# Altium project CME-M5_DevBrd.PrjPcb
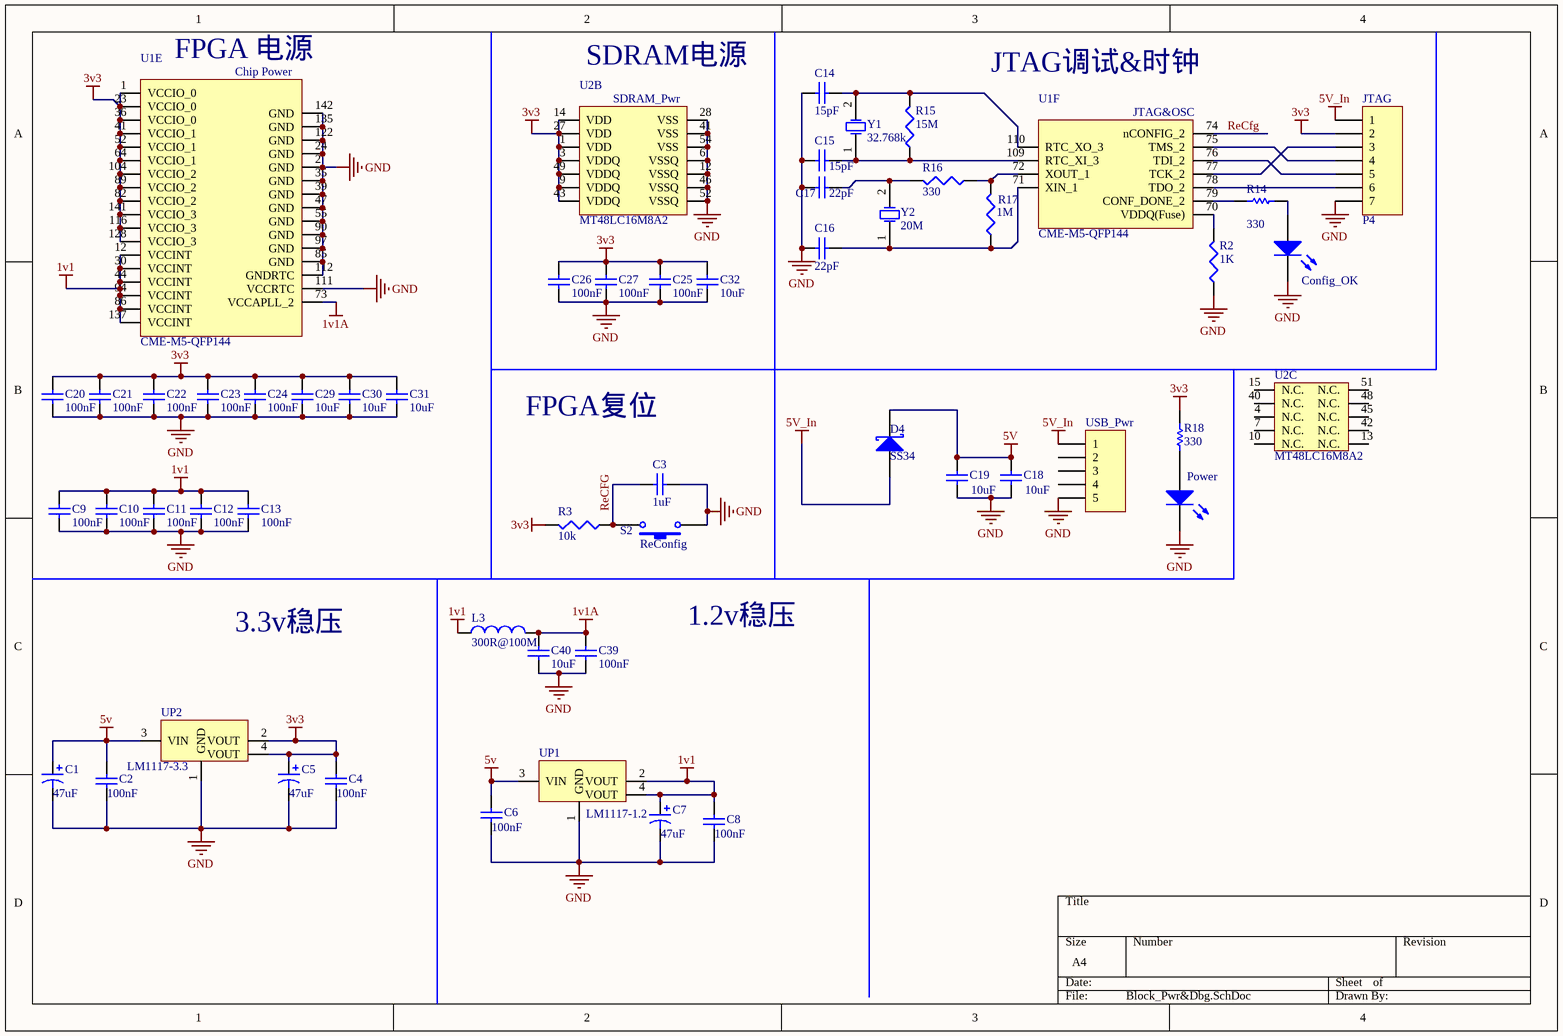
[diagram p0: Block_Pwr&Dbg.SchDoc]
2 sheets, 58 parts. Net scope: global (net labels, ports and power ports of the same name join across sheets).
Board file: CME-M5_DevBrd.PcbDoc
Sheets:
  Block_Pwr&Dbg.SchDoc
  CME-M5_DevBrd.SchDoc

## Sheet Block_Pwr&Dbg.SchDoc
size A4

### Parts
(Parts that share a designator on the sheet are numbered #1, #2 ... from top to bottom, then left to right.)
C1  value 47uF  [TanCap-1210]  (hidden comment: Cap Pol3)
C2  value 100nF  [6-0805_M]  (hidden comment: Cap)
C3  value 1uF  [6-0805_M]  (hidden comment: Cap)
C4  value 100nF  [6-0805_M]  (hidden comment: Cap)
C5  value 47uF  [TanCap-1210]  (hidden comment: Cap Pol3)
C6  value 100nF  [6-0805_M]  (hidden comment: Cap)
C7  value 47uF  [TanCap-1210]  (hidden comment: Cap Pol3)
C8  value 100nF  [6-0805_M]  (hidden comment: Cap)
C9  value 100nF  [6-0805_M]  (hidden comment: Cap)
C10  value 100nF  [6-0805_M]  (hidden comment: Cap)
C11  value 100nF  [6-0805_M]  (hidden comment: Cap)
C12  value 100nF  [6-0805_M]  (hidden comment: Cap)
C13  value 100nF  [6-0805_M]  (hidden comment: Cap)
C14  value 15pF  [6-0805_M]  (hidden comment: Cap)
C15  value 15pF  [6-0805_M]  (hidden comment: Cap)
C16  value 22pF  [6-0805_M]  (hidden comment: Cap)
C17  value 22pF  [6-0805_M]  (hidden comment: Cap)
C18  value 10uF  [6-0805_M]  (hidden comment: Cap)
C19  value 10uF  [6-0805_M]  (hidden comment: Cap)
C20  value 100nF  [6-0805_M]  (hidden comment: Cap)
C21  value 100nF  [6-0805_M]  (hidden comment: Cap)
C22  value 100nF  [6-0805_M]  (hidden comment: Cap)
C23  value 100nF  [6-0805_M]  (hidden comment: Cap)
C24  value 100nF  [6-0805_M]  (hidden comment: Cap)
C25  value 100nF  [6-0805_M]  (hidden comment: Cap)
C26  value 100nF  [6-0805_M]  (hidden comment: Cap)
C27  value 100nF  [6-0805_M]  (hidden comment: Cap)
C29  value 10uF  [6-0805_M]  (hidden comment: Cap)
C30  value 10uF  [6-0805_M]  (hidden comment: Cap)
C31  value 10uF  [6-0805_M]  (hidden comment: Cap)
C32  value 10uF  [6-0805_M]  (hidden comment: Cap)
C39#1  value 100nF  [6-0805_M]  (hidden comment: Cap)
C40  value 10uF  [6-0805_M]  (hidden comment: Cap)
Config_OK  LED2  [6-0805_Diode]  (value not drawn)
D4  SS34  [SMB]
JTAG  P4  [HDR1X7]
L3  value 300R@100M  [6-0805_M]  (hidden comment: Inductor)
Power  LED2  [6-0805_Diode]  (value not drawn)
R2  value 1K  [6-0805_M]  (hidden comment: Res3)
R3  value 10k  [6-0805_M]  (hidden comment: Res3)
R14  value 330  [6-0805_M]  (hidden comment: Res1)
R15  value 15M  [6-0805_M]  (hidden comment: Res3)
R16  value 330  [6-0805_M]  (hidden comment: Res3)
R17  value 1M  [6-0805_M]  (hidden comment: Res3)
R18  value 330  [6-0805_M]  (hidden comment: Res1)
ReConfig  S2  [Switch_SMT-022S-H2.5]
U1  CME-M5-QFP144  [QFP144N-50P2200X2200X160]  (parts E,F of 6)
U2  MT48LC16M8A2  [TSOP54-80P1180X100-]  (parts B,C of 3)
UP1  LM1117-1.2  [SOT223_M]
UP2  LM1117-3.3  [SOT223_M]
USB_Pwr  Header 5  [MicroUSB]  (value not drawn)
Y1  32.768k  [XTAL-3215]
Y2  20M  [XTAL-5032]

### Nets
1v1: C7.1 C8.2 C9.2 C10.2 C11.2 C12.2 C13.2 L3.1 U1.12(VCCINT) U1.30(VCCINT) U1.44(VCCINT) U1.86(VCCINT) U1.94(VCCINT) U1.137(VCCINT) UP1.2(VOUT) UP1.4(VOUT)
1v1A: C39#1.2 C40.2 L3.2 U1.73(VCCAPLL_2)
3v3: C4.2 C5.1 C20.2 C21.2 C22.2 C23.2 C24.2 C25.2 C26.2 C27.2 C29.2 C30.2 C31.2 C32.2 JTAG.2 R3.2 R18.1 U1.1(VCCIO_0) U1.23(VCCIO_0) U1.36(VCCIO_0) U1.41(VCCIO_1) U1.52(VCCIO_1) U1.64(VCCIO_1) U1.82(VCCIO_2) U1.89(VCCIO_2) U1.104(VCCIO_2) U1.116(VCCIO_3) U1.128(VCCIO_3) U1.141(VCCIO_3) U2.1(VDD) U2.3(VDDQ) U2.9(VDDQ) U2.14(VDD) U2.27(VDD) U2.43(VDDQ) U2.49(VDDQ) UP2.2(VOUT) UP2.4(VOUT)
5V: C1.1 C2.2 C6.2 C18.2 C19.2 D4.2(K) UP1.3(VIN) UP2.3(VIN)
5V_In: D4.1(A) JTAG.1 USB_Pwr.1
GND: C1.2 C2.1 C3.1 C4.1 C5.2 C6.1 C7.2 C8.1 C9.1 C10.1 C11.1 C12.1 C13.1 C14.1 C15.1 C16.1 C17.1 C18.1 C19.1 C20.1 C21.1 C22.1 C23.1 C24.1 C25.1 C26.1 C27.1 C29.1 C30.1 C31.1 C32.1 C39#1.1 C40.1 Config_OK.2(K) JTAG.7 Power.2(K) R2.1 ReConfig.1 U1.2(GND) U1.24(GND) U1.35(GND) U1.39(GND) U1.47(GND) U1.55(GND) U1.85(GND) U1.90(GND) U1.97(GND) U1.111(VCCRTC) U1.112(GNDRTC) U1.122(GND) U1.135(GND) U1.142(GND) U2.6(VSSQ) U2.12(VSSQ) U2.28(VSS) U2.41(VSS) U2.46(VSSQ) U2.52(VSSQ) U2.54(VSS) UP1.1(GND) UP2.1(GND) USB_Pwr.5
ReCfg: C3.2 R3.1 ReConfig.2 U1.74(nCONFIG_2)
NetC14_2: C14.2 R15.2 U1.110(RTC_XO_3) Y1.2(OSC2)
NetC15_2: C15.2 R15.1 U1.109(RTC_XI_3) Y1.1(OSC1)
NetC16_2: C16.2 R17.1 U1.71(XIN_1) Y2.1(OSC1)
NetC17_2: C17.2 R16.2 Y2.2(OSC2)
NetConfig_OK_1: Config_OK.1(A) R14.2
NetJTAG_3: JTAG.3 U1.77(TCK_2)
NetJTAG_4: JTAG.4 U1.75(TMS_2)
NetJTAG_5: JTAG.5 U1.76(TDI_2)
NetJTAG_6: JTAG.6 U1.78(TDO_2)
NetPower_1: Power.1(A) R18.2
NetR2_2: R2.2 U1.70(VDDQ(Fuse))
NetR14_1: R14.1 U1.79(CONF_DONE_2)
NetR16_1: R16.1 R17.2 U1.72(XOUT_1)

Not connected (* = marked no-connect by the designer): U2 4(N.C.) 7(N.C.) 10(N.C.) 13(N.C.) 15(N.C.) 40(N.C.) 42(N.C.) 45(N.C.) 48(N.C.) 51(N.C.); USB_Pwr 2 3 4

### Notes on the sheet
- (near U1) FPGA 电源
- (near U2) SDRAM电源
- JTAG调试&时钟
- FPGA复位
- 3.3v稳压
- 1.2v稳压
- (in symbol CME-M5-QFP144, part E) Chip Power
- (in symbol CME-M5-QFP144, part F) JTAG&OSC
- (in symbol SDRAM-8, part B) SDRAM_Pwr

### Library data of the parts
C1 C5 C7 = Cap Pol3: Polarized Capacitor (Surface Mount); Published: 8-Jun-2000; LatestRevisionDate: 29-May-2009; LatestRevisionNote: IPC-7351 Footprint Added.; PackageReference: C0805; Publisher: Altium Limited; PackageDescription: Chip Capacitor
C2-C4 C6 C8-C27 C29-C32 C39#1 C40 = Cap: Capacitor; Published: 8-Jun-2000; LatestRevisionDate: 17-Jul-2002; LatestRevisionNote: Re-released for DXP Platform.; PackageReference: RAD-0.3; Publisher: Altium Limited; PackageDescription: Radial Cap, Thru-Hole; 2 Leads; 0.3 in Pin Spacing
Config_OK Power = LED2: Typical RED, GREEN, YELLOW, AMBER GaAs LED; Published: 8-Jun-2000; LatestRevisionDate: 17-Jul-2002; LatestRevisionNote: Re-released for DXP Platform.; PackageVersion: Feb-2002; PackageReference: 3.2X1.6X1.1; Publisher: Altium Limited; PackageDescription: SM LED; 2 Flat Leads
D4 = D Schottky: Schottky Diode; Published: 8-Jun-2000; LatestRevisionDate: 17-Jul-2002; LatestRevisionNote: Re-released for DXP Platform.; PackageReference: SMB; Publisher: Altium Limited; PackageDescription: DO-214-AA/SMB; 2 C-Bend Leads; Body 5.3 x 3.6 mm, inc. leads (LxW); Code_JEDEC: DO-214-AA
JTAG = Header 7: Header, 7-Pin; LatestRevisionDate: 17-Jul-2002; LatestRevisionNote: Re-released for DXP Platform.; Publisher: Altium Limited
L3 = Inductor: Code_IEC: 1005; Published: 8-Jun-2000; LatestRevisionDate: 29-May-2009; LatestRevisionNote: IPC-7351 Footprint Added.; PackageReference: 0402-A; Publisher: Altium Limited; PackageDescription: Chip Inductor; Code_JEITA: 0402
R2 R3 R15-R17 = Res3: Resistor; Published: 8-Jun-2000; LatestRevisionDate: 29-May-2009; LatestRevisionNote: IPC-7351 Footprint Added.; PackageReference: J1-0603; Publisher: Altium Limited; PackageDescription: Chip Resistor
R14 R18 = Res1: Resistor; Published: 8-Jun-2000; LatestRevisionDate: 17-Jul-2002; LatestRevisionNote: Re-released for DXP Platform.; PackageReference: AXIAL-0.3; Publisher: Altium Limited; PackageDescription: Axial Device, Thru-Hole; 2 Leads; 0.3 in Pin Spacing
ReConfig = SW-PB: Switch; Published: 24-Mar-1999; LatestRevisionDate: 17-Jul-2002; LatestRevisionNote: Re-released for DXP Platform.; PackageReference: SPST-2; Publisher: Altium Limited; PackageDescription: Switch; 2 Leads
U2 = SDRAM-8
UP1 UP2 = LM1117
USB_Pwr = Header 5: Header, 5-Pin; LatestRevisionDate: 17-Jul-2002; LatestRevisionNote: Re-released for DXP Platform.; Publisher: Altium Limited
Y1 Y2 = XTAL: Crystal Oscillator; Published: 8-Jun-2000; LatestRevisionDate: 17-Jul-2002; LatestRevisionNote: Re-released for DXP Platform.; PackageReference: R38; Publisher: Altium Limited; PackageDescription: Crystal, Thru-Hole; 2 Leads; Body 3.1 x 8.2 mm (Dia.xH)

## Sheet CME-M5_DevBrd.SchDoc
size A4
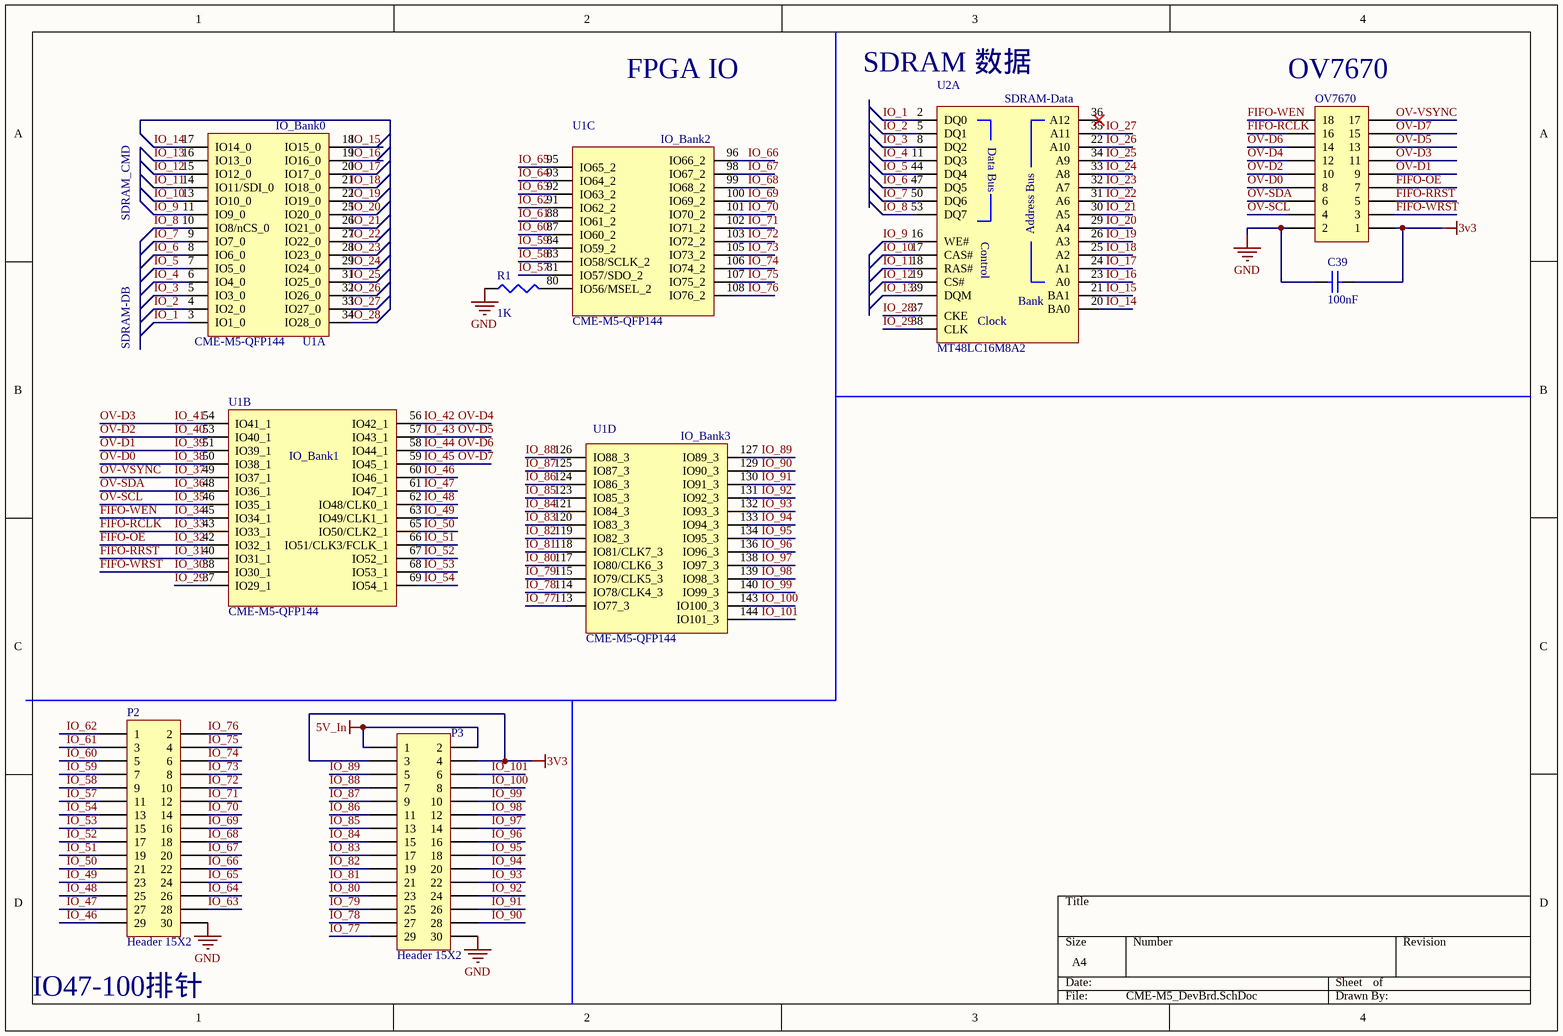
[diagram p1: CME-M5_DevBrd.SchDoc]

### Parts
(Parts that share a designator on the sheet are numbered #1, #2 ... from top to bottom, then left to right.)
C39#2  value 100nF  [6-0805_M]  (hidden comment: Cap)
OV7670  OV7670  [HDR2X9]  (value not drawn)
P2  Header 15X2  [HDR2X15]
P3  Header 15X2  [HDR2X15]
R1  value 1K  [6-0805_M]  (hidden comment: Res3)
U1  CME-M5-QFP144  [QFP144N-50P2200X2200X160]  (parts A,B,C,D of 6)
U2  MT48LC16M8A2  [TSOP54-80P1180X100-]  (part A of 3)

### Nets
3v3: C39#2.2 OV7670.1 P3.3 P3.4
5V_In: P3.1 P3.2
GND: C39#2.1 OV7670.2 P2.30 P3.30 R1.1
FIFO-OE: OV7670.7 U1.42(IO32_1)  [also labelled IO_32]
FIFO-RCLK: OV7670.16 U1.43(IO33_1)  [also labelled IO_33]
FIFO-RRST: OV7670.5 U1.40(IO31_1)  [also labelled IO_31]
FIFO-WEN: OV7670.18 U1.45(IO34_1)  [also labelled IO_34]
FIFO-WRST: OV7670.3 U1.38(IO30_1)  [also labelled IO_30]
IO_1: U1.3(IO1_0) U2.2(DQ0)
IO_2: U1.4(IO2_0) U2.5(DQ1)
IO_3: U1.5(IO3_0) U2.8(DQ2)
IO_4: U1.6(IO4_0) U2.11(DQ3)
IO_5: U1.7(IO5_0) U2.44(DQ4)
IO_6: U1.8(IO6_0) U2.47(DQ5)
IO_7: U1.9(IO7_0) U2.50(DQ6)
IO_8: U1.10(IO8/nCS_0) U2.53(DQ7)
IO_9: U1.11(IO9_0) U2.16(WE#)
IO_10: U1.13(IO10_0) U2.17(CAS#)
IO_11: U1.14(IO11/SDI_0) U2.18(RAS#)
IO_12: U1.15(IO12_0) U2.19(CS#)
IO_13: U1.16(IO13_0) U2.39(DQM)
IO_14: U1.17(IO14_0) U2.20(BA0)
IO_15: U1.18(IO15_0) U2.21(BA1)
IO_16: U1.19(IO16_0) U2.23(A0)
IO_17: U1.20(IO17_0) U2.24(A1)
IO_18: U1.21(IO18_0) U2.25(A2)
IO_19: U1.22(IO19_0) U2.26(A3)
IO_20: U1.25(IO20_0) U2.29(A4)
IO_21: U1.26(IO21_0) U2.30(A5)
IO_22: U1.27(IO22_0) U2.31(A6)
IO_23: U1.28(IO23_0) U2.32(A7)
IO_24: U1.29(IO24_0) U2.33(A8)
IO_25: U1.31(IO25_0) U2.34(A9)
IO_26: U1.32(IO26_0) U2.22(A10)
IO_27: U1.33(IO27_0) U2.35(A11)
IO_28: U1.34(IO28_0) U2.37(CKE)
IO_29: U1.37(IO29_1) U2.38(CLK)
IO_35: OV7670.4 U1.46(IO35_1)  [also labelled OV-SCL]
IO_36: OV7670.6 U1.48(IO36_1)  [also labelled OV-SDA]
IO_37: OV7670.17 U1.49(IO37_1)  [also labelled OV-VSYNC]
IO_38: OV7670.8 U1.50(IO38_1)  [also labelled OV-D0]
IO_39: OV7670.9 U1.51(IO39_1)  [also labelled OV-D1]
IO_40: OV7670.10 U1.53(IO40_1)  [also labelled OV-D2]
IO_41: OV7670.11 U1.54(IO41_1)  [also labelled OV-D3]
IO_42: OV7670.12 U1.56(IO42_1)  [also labelled OV-D4]
IO_43: OV7670.13 U1.57(IO43_1)  [also labelled OV-D5]
IO_44: OV7670.14 U1.58(IO44_1)  [also labelled OV-D6]
IO_45: OV7670.15 U1.59(IO45_1)  [also labelled OV-D7]
IO_46: P2.29 U1.60(IO46_1)
IO_47: P2.27 U1.61(IO47_1)
IO_48: P2.25 U1.62(IO48/CLK0_1)
IO_49: P2.23 U1.63(IO49/CLK1_1)
IO_50: P2.21 U1.65(IO50/CLK2_1)
IO_51: P2.19 U1.66(IO51/CLK3/FCLK_1)
IO_52: P2.17 U1.67(IO52_1)
IO_53: P2.15 U1.68(IO53_1)
IO_54: P2.13 U1.69(IO54_1)
IO_57: P2.11 U1.81(IO57/SDO_2)
IO_58: P2.9 U1.83(IO58/SCLK_2)
IO_59: P2.7 U1.84(IO59_2)
IO_60: P2.5 U1.87(IO60_2)
IO_61: P2.3 U1.88(IO61_2)
IO_62: P2.1 U1.91(IO62_2)
IO_63: P2.28 U1.92(IO63_2)
IO_64: P2.26 U1.93(IO64_2)
IO_65: P2.24 U1.95(IO65_2)
IO_66: P2.22 U1.96(IO66_2)
IO_67: P2.20 U1.98(IO67_2)
IO_68: P2.18 U1.99(IO68_2)
IO_69: P2.16 U1.100(IO69_2)
IO_70: P2.14 U1.101(IO70_2)
IO_71: P2.12 U1.102(IO71_2)
IO_72: P2.10 U1.103(IO72_2)
IO_73: P2.8 U1.105(IO73_2)
IO_74: P2.6 U1.106(IO74_2)
IO_75: P2.4 U1.107(IO75_2)
IO_76: P2.2 U1.108(IO76_2)
IO_77: P3.29 U1.113(IO77_3)
IO_78: P3.27 U1.114(IO78/CLK4_3)
IO_79: P3.25 U1.115(IO79/CLK5_3)
IO_80: P3.23 U1.117(IO80/CLK6_3)
IO_81: P3.21 U1.118(IO81/CLK7_3)
IO_82: P3.19 U1.119(IO82_3)
IO_83: P3.17 U1.120(IO83_3)
IO_84: P3.15 U1.121(IO84_3)
IO_85: P3.13 U1.123(IO85_3)
IO_86: P3.11 U1.124(IO86_3)
IO_87: P3.9 U1.125(IO87_3)
IO_88: P3.7 U1.126(IO88_3)
IO_89: P3.5 U1.127(IO89_3)
IO_90: P3.28 U1.129(IO90_3)
IO_91: P3.26 U1.130(IO91_3)
IO_92: P3.24 U1.131(IO92_3)
IO_93: P3.22 U1.132(IO93_3)
IO_94: P3.20 U1.133(IO94_3)
IO_95: P3.18 U1.134(IO95_3)
IO_96: P3.16 U1.136(IO96_3)
IO_97: P3.14 U1.138(IO97_3)
IO_98: P3.12 U1.139(IO98_3)
IO_99: P3.10 U1.140(IO99_3)
IO_100: P3.8 U1.143(IO100_3)
IO_101: P3.6 U1.144(IO101_3)
NetR1_2: R1.2 U1.80(IO56/MSEL_2)

Not connected (* = marked no-connect by the designer): U2 36(A12)*

### Notes on the sheet
- FPGA IO
- (near U2) SDRAM 数据
- (near OV7670) OV7670
- SDRAM_CMD
- SDRAM-DB
- (near P2) IO47-100排针
- (in symbol CME-M5-QFP144, part A) IO_Bank0
- (in symbol CME-M5-QFP144, part B) IO_Bank1
- (in symbol CME-M5-QFP144, part C) IO_Bank2
- (in symbol CME-M5-QFP144, part D) IO_Bank3
- (in symbol SDRAM-8, part A) SDRAM-Data; Data Bus; Address Bus; Control; Bank; Clock

### Library data of the parts
C39#2 = Cap: Capacitor; Published: 8-Jun-2000; LatestRevisionDate: 17-Jul-2002; LatestRevisionNote: Re-released for DXP Platform.; PackageReference: RAD-0.3; Publisher: Altium Limited; PackageDescription: Radial Cap, Thru-Hole; 2 Leads; 0.3 in Pin Spacing
OV7670 = Header 9X2: Header, 9-Pin, Dual row; LatestRevisionDate: 17-Jul-2002; LatestRevisionNote: Re-released for DXP Platform.; Publisher: Altium Limited
P2 P3 = Header 15X2: Header, 15-Pin, Dual row; LatestRevisionDate: 17-Jul-2002; LatestRevisionNote: Re-released for DXP Platform.; Publisher: Altium Limited
R1 = Res3: Resistor; Published: 8-Jun-2000; LatestRevisionDate: 29-May-2009; LatestRevisionNote: IPC-7351 Footprint Added.; PackageReference: J1-0603; Publisher: Altium Limited; PackageDescription: Chip Resistor
U2 = SDRAM-8

## Nets that join several sheets
3v3: Block_Pwr&Dbg (38 pins), CME-M5_DevBrd (C39#2.2 OV7670.1 P3.3 P3.4)
5V_In: Block_Pwr&Dbg (D4.1 JTAG.1 USB_Pwr.1), CME-M5_DevBrd (P3.1 P3.2)
GND: Block_Pwr&Dbg (62 pins), CME-M5_DevBrd (5 pins)